# Altium schematic sheet MainController.SchDoc
size A4; SheetNumber: 11; SheetTotal: 13
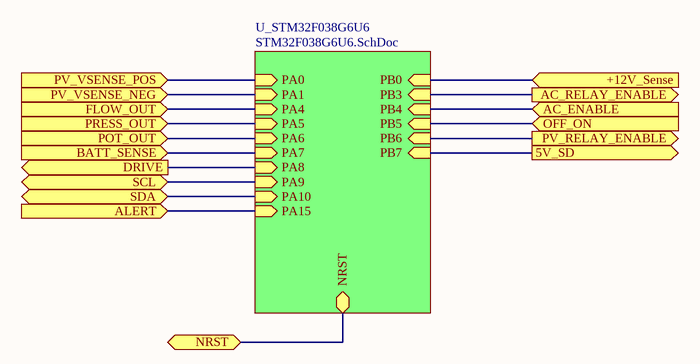
[diagram p0: MainController.SchDoc]

## Sub-sheets
U_STM32F038G6U6 = STM32F038G6U6.SchDoc: NRST (bidir), PB0 (in), PB3 (in), PB4 (in), PB5 (in), PB6 (in), PB7 (in), PA0 (in), PA1 (in), PA4 (in), PA5 (in), PA6 (in), PA7 (in), PA8 (in), PA9 (in), PA10 (in), PA15 (in)

## Ports
5V_SD (out), +12V_Sense (in), AC_ENABLE (in), AC_RELAY_ENABLE (out), ALERT (in), BATT_SENSE (in), DRIVE (out), FLOW_OUT (in), NRST (bidir), OFF_ON (in), POT_OUT (in), PRESS_OUT (in), PV_RELAY_ENABLE (out), PV_VSENSE_NEG (in), PV_VSENSE_POS (in), SCL (bidir), SDA (bidir)

## Nets
5V_SD: port 5V_SD, sheet U_STM32F038G6U6/PB7
+12V_Sense: port +12V_Sense, sheet U_STM32F038G6U6/PB0
AC_ENABLE: port AC_ENABLE, sheet U_STM32F038G6U6/PB4
AC_RELAY_ENABLE: port AC_RELAY_ENABLE, sheet U_STM32F038G6U6/PB3
ALERT: port ALERT, sheet U_STM32F038G6U6/PA15
BATT_SENSE: port BATT_SENSE, sheet U_STM32F038G6U6/PA7
DRIVE: port DRIVE, sheet U_STM32F038G6U6/PA8
FLOW_OUT: port FLOW_OUT, sheet U_STM32F038G6U6/PA4
NRST: port NRST, sheet U_STM32F038G6U6/NRST
OFF_ON: port OFF_ON, sheet U_STM32F038G6U6/PB5
POT_OUT: port POT_OUT, sheet U_STM32F038G6U6/PA6
PRESS_OUT: port PRESS_OUT, sheet U_STM32F038G6U6/PA5
PV_RELAY_ENABLE: port PV_RELAY_ENABLE, sheet U_STM32F038G6U6/PB6
PV_VSENSE_NEG: port PV_VSENSE_NEG, sheet U_STM32F038G6U6/PA1
PV_VSENSE_POS: port PV_VSENSE_POS, sheet U_STM32F038G6U6/PA0
SCL: port SCL, sheet U_STM32F038G6U6/PA9
SDA: port SDA, sheet U_STM32F038G6U6/PA10